# Altium project STM32_BluePill.PrjPcb
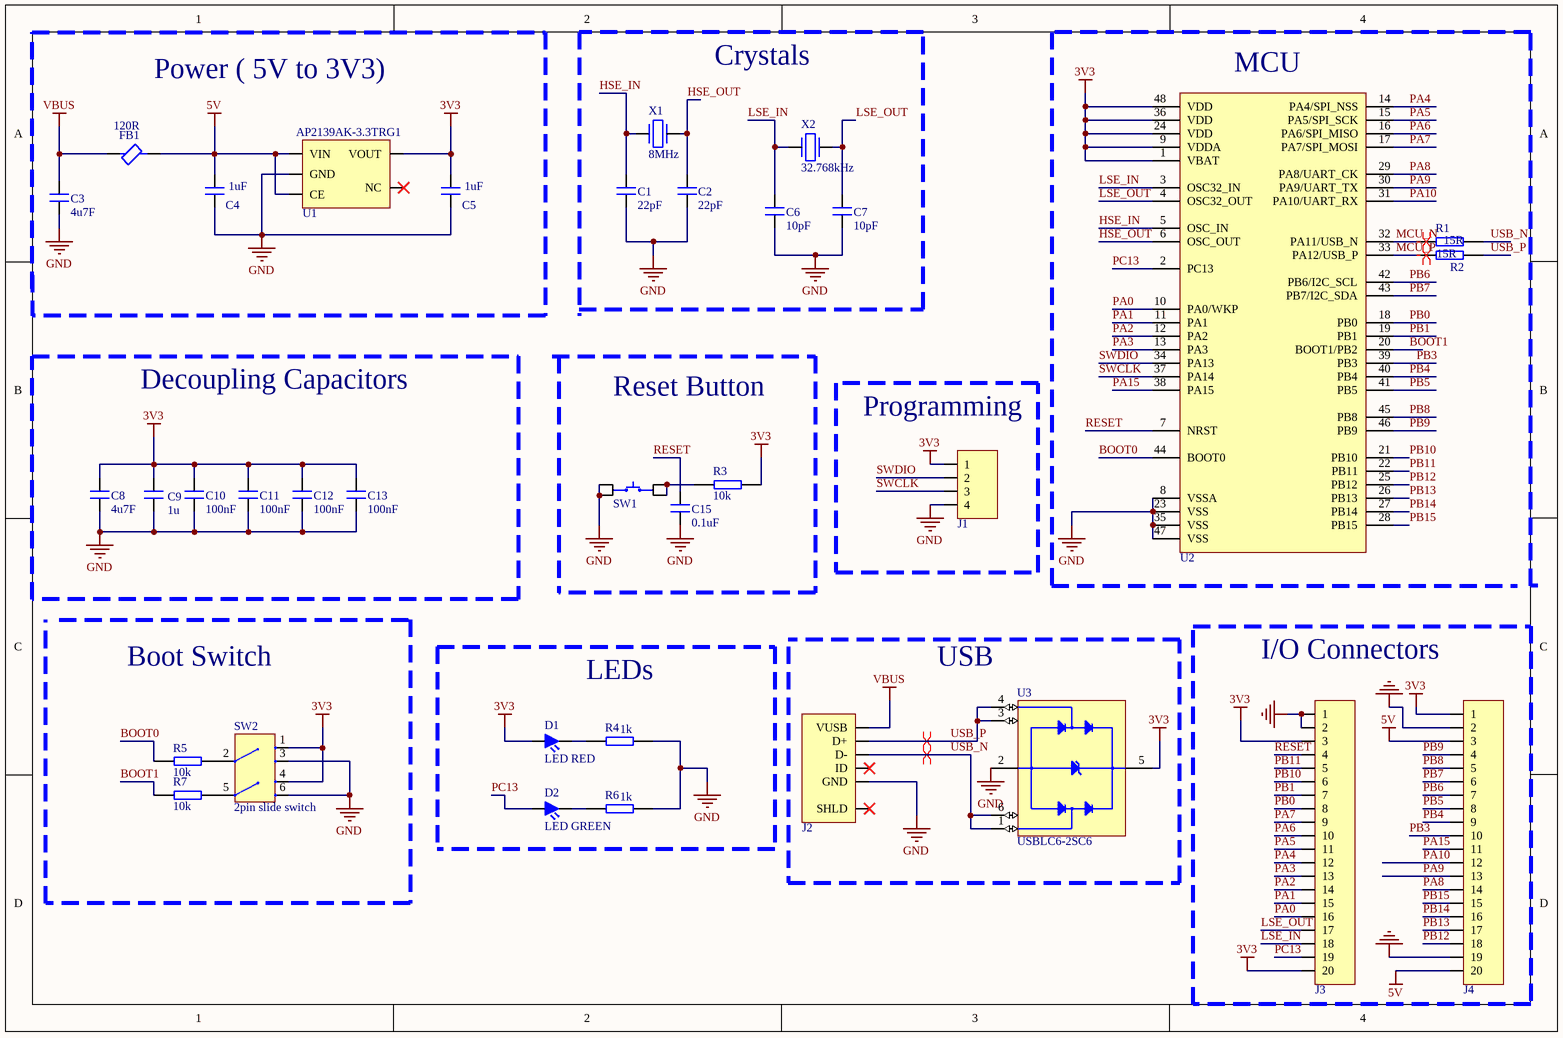
[diagram p0: STM32BluePill.SchDoc]
1 sheet, 35 parts. Net scope: global (net labels, ports and power ports of the same name join across sheets).
Board file: STM32_BluePill.PcbDoc

## Sheet STM32BluePill.SchDoc
size A4; SheetNumber: 1; SheetTotal: 2

### Parts
C1  22pF  [0402 CAP]
C2  22pF  [0402 CAP]
C3  4u7F  [0603 CAP]
C4  1uF  [0603 CAP]
C5  1uF  [0603 CAP]
C6  10pF  [0402 CAP]
C7  10pF  [0402 CAP]
C8  4u7F  [0603 CAP]
C9  1u  [0603 CAP]
C10  100nF  [0402 CAP]
C11  100nF  [0402 CAP]
C12  100nF  [0402 CAP]
C13  100nF  [0402 CAP]
C15  0.1uF  [0402 CAP]
D1  LED RED  [LED 0805]
D2  LED GREEN  [LED 0805]
FB1  120R  [0402 RES]
J1  Header 2.54MM 4POS 90D Male  [4pin 90degree header 2.54mm]  (value not drawn)
J2  10118192-0001LF  [10118192-0001LF]  (value not drawn)
J3  Header 2.54MM 20POS Male  [20pin Male Header 2.54mm]  (value not drawn)
J4  Header 2.54MM 20POS Male  [20pin Male Header 2.54mm]  (value not drawn)
R1  15R  [0402 RES]
R2  15R  [0402 RES]
R3  10k  [0402 RES]
R4  1k  [0402 RES]
R5  10k  [0402 RES]
R6  1k  [0402 RES]
R7  10k  [0402 RES]
SW1  SWITCH TACTILE  [4 pin tactile switch]  (value not drawn)
SW2  2pin slide switch  [CAS-D20TA]
U1  AP2139AK-3.3TRG1  [SOT-23-5]
U2  STM32F103C6T6A  [LQFP-48]  (value not drawn)
U3  USBLC6-2SC6  [SOT23-6]
X1  8MHz  [XR8M000000S416]
X2  32.768kHz  [ECX-1210]

### Blocks framed on the sheet
Decoupling Capacitors: C8-C13
Programming: J1
I/O Connectors: J3 J4
LEDs: D1 D2 R4 R6

### Nets
3V3: C5.2 C8.2 C9.2 C10.2 C11.2 C12.2 C13.2 D1.2 J1.1 J3.3 J3.20 J4.1 R3.2 SW2.1 SW2.4 U1.5(VOUT) U2.1(VBAT) U2.9(VDDA) U2.24(VDD) U2.36(VDD) U2.48(VDD) U3.5(VBUS)
5V: C4.2 FB1.2 J4.3 J4.20 U1.1(VIN) U1.3(CE)
GND: C1.1 C2.1 C3.1 C4.1 C5.1 C6.1 C7.1 C8.1 C9.1 C10.1 C11.1 C12.1 C13.1 C15.1 J1.4 J2.5(GND) J3.1 J3.2 J4.2 J4.19 R4.2 R6.2 SW1.1 SW1.3 SW2.3 SW2.6 U1.2(GND) U2.8(VSSA) U2.23(VSS) U2.35(VSS) U2.47(VSS) U3.2(GND)
VBUS: C3.2 FB1.1 J2.1(VUSB)
BOOT0: R5.1 U2.44(BOOT0)
BOOT1: R7.1 U2.20(BOOT1/PB2)
HSE_IN: C1.2 U2.5(OSC_IN) X1.1
HSE_OUT: C2.2 U2.6(OSC_OUT) X1.2
LSE_IN: C6.2 J3.18 U2.3(OSC32_IN) X2.2
LSE_OUT: C7.2 J3.17 U2.4(OSC32_OUT) X2.1
MCU_N: R1.2 U2.32(PA11/USB_N)
MCU_P: R2.1 U2.33(PA12/USB_P)
PA0: J3.16 U2.10(PA0/WKP)
PA1: J3.15 U2.11(PA1)
PA2: J3.14 U2.12(PA2)
PA3: J3.13 U2.13(PA3)
PA4: J3.12 U2.14(PA4/SPI_NSS)
PA5: J3.11 U2.15(PA5/SPI_SCK)
PA6: J3.10 U2.16(PA6/SPI_MISO)
PA7: J3.9 U2.17(PA7/SPI_MOSI)
PA8: J4.14 U2.29(PA8/UART_CK)
PA9: J4.13 U2.30(PA9/UART_TX)
PA10: J4.12 U2.31(PA10/UART_RX)
PA15: J4.11 U2.38(PA15)
PB0: J3.8 U2.18(PB0)
PB1: J3.7 U2.19(PB1)
PB3: J4.10 U2.39(PB3)
PB4: J4.9 U2.40(PB4)
PB5: J4.8 U2.41(PB5)
PB6: J4.7 U2.42(PB6/I2C_SCL)
PB7: J4.6 U2.43(PB7/I2C_SDA)
PB8: J4.5 U2.45(PB8)
PB9: J4.4 U2.46(PB9)
PB10: J3.6 U2.21(PB10)
PB11: J3.5 U2.22(PB11)
PB12: J4.18 U2.25(PB12)
PB13: J4.17 U2.26(PB13)
PB14: J4.16 U2.27(PB14)
PB15: J4.15 U2.28(PB15)
PC13: D2.2 J3.19 U2.2(PC13)
RESET: C15.2 J3.4 U2.7(NRST)
SWCLK: J1.3 U2.37(PA14)
SWDIO: J1.2 U2.34(PA13)
USB_N: J2.3(D-) R1.1 U3.1(I/O1) U3.6(I/O1)
USB_P: J2.2(D+) R2.2 U3.3(I/O2) U3.4(I/O2)
NetD1_1: D1.1 R4.1
NetD2_1: D2.1 R6.1
NetR3_1: R3.1 SW1.2 SW1.4
NetR5_2: R5.2 SW2.2
NetR7_2: R7.2 SW2.5

Not connected (* = marked no-connect by the designer): J2 4(ID)* 6(SHLD)*; U1 4(NC)*

### Layout directives
differential pair: MCU_N, MCU_P, USB_N, USB_P

### Notes on the sheet
- Power ( 5V to 3V3)
- Crystals
- (near U2) MCU
- Reset Button
- Boot Switch
- (near U3) USB

### Library data of the parts
C1 C2 = 0402 22p CAP: Ceramic Capacitor, Multilayer, Ceramic, 50V, 5% +Tol, 5% -Tol, C0G, 30ppm/Cel TC, 0.000022uF, Surface Mount, 0402; Manufacturer: Murata; Manufacturer Part Number: GRM1555C1H220JA01D; Multilayer: Yes; Case: 0402; Supplier: Digikey; Supplier Part Number: 490-5868-1-ND; RoHS: Yes; Category: Ceramic Capacitors; Stock: 1670141; Pricing: 1=0,1, 10=0,029, 50=0,0166, 100=0,0129, 500=0,00974, 1000=0,00765, 2500=0,00695, 5000=0,0064 (USD); Mounting Technology: Surface Mount; Pins: 2; Package Shape: Rectangular; Case/Package: 0402; Terminal Finish: Nickel; Dielectric Material: Ceramic; Min Operating Temperature: -55°C; Max Operating Temperature: 125°C; JESD-609 Code: e3; Package Style: SMTMeter; Packaging: Tape and Reel; Termination: Wraparound; Value: 22pF; Capacitor Type: Ceramic; Tolerance  (fill in as +-): 5%; Tolerance (fill in as +-): 5%; Rated DC Voltage (URdc): 50V; Temperature Characteristics Code: C0G; Length: 1mm; Width: 0.5mm; Height: 0.5mm; Reach SVHC Compliant: Yes; RoHS Compliant: Yes; ComponentLink1URL: https://datasheet.ciiva.com:443/pdfs/VipMasterIC/IC/MURE/MURE-S-A0008911154/MURE-S-A0008911207-1.pdf?src-supplier=IHS+Markit; ComponentLink1Description: https://datasheet.ciiva.com:443/pdfs/VipMasterIC/IC/MURE/MURE-S-A0008911154/MURE-S-A0008911207-1.pdf?src-supplier=IHS+Markit; ComponentLink2URL: https://datasheet.ciiva.com/6277/product-6277809.pdf?src-supplier=Digikey; ComponentLink2Description: https://datasheet.ciiva.com/6277/product-6277809.pdf?src-supplier=Digikey; ComponentLink3URL: https://datasheet.ciiva.com/29200/453714-da-01-en-vs-kondensator-0402-29200051.pdf?src-supplier=Conrad; ComponentLink3Description: https://datasheet.ciiva.com/29200/453714-da-01-en-vs-kondensator-0402-29200051.pdf?src-supplier=Conrad; ComponentLink4URL: https://datasheet.ciiva.com/7828/1666664-7828846.pdf?src-supplier=Element14; ComponentLink4Description: https://datasheet.ciiva.com/7828/1666664-7828846.pdf?src-supplier=Element14
C3 C8 = 0603 4u7 CAP: Ceramic Capacitor, Multilayer, Ceramic, 25V, 10% +Tol, 10% -Tol, X5R, 15% TC, 4.7uF, Surface Mount, 0603; Manufacturer: Samsung; Manufacturer Part Number: CL10A475KA8NQNC; Multilayer: Yes; Case: 0603; Supplier: Digikey; Supplier Part Number: 1276-1900-1-ND; RoHS: Yes; Category: Ceramic Capacitors; Stock: 1806164; Pricing: 1=0,35, 10=0,226, 50=0,1584, 100=0,1279, 500=0,09502, 1000=0,08314 (USD); Mounting Technology: Surface Mount; Pins: 2; Package Shape: Rectangular; Terminal Finish: Nickel; Dielectric Material: Ceramic; Case/Package: 0603; Min Operating Temperature: -55°C; Max Operating Temperature: 85°C; JESD-609 Code: e3; Package Style: SMTMeter; Value: 4.7uF; Capacitor Type: Ceramic; Tolerance  (fill in as +-): 10%; Packaging: Tape and Reel; Tolerance (fill in as +-): 10%; Rated DC Voltage (URdc): 25V; Temperature Characteristics Code: X5R; Termination: Wraparound; Length: 1.6mm; Width: 0.8mm; Height: 0.95mm; Reach SVHC Compliant: Yes; RoHS Compliant: Yes; ComponentLink1URL: https://datasheet.ciiva.com:443/pdfs/VipMasterIC/IC/SEMS/SEMS-S-A0008384515/SEMS-S-A0008873295-1.pdf?src-supplier=IHS+Markit; ComponentLink1Description: https://datasheet.ciiva.com:443/pdfs/VipMasterIC/IC/SEMS/SEMS-S-A0008384515/SEMS-S-A0008873295-1.pdf?src-supplier=IHS+Markit; ComponentLink2URL: https://datasheet.ciiva.com/25787/cl10a475ka8nqnc-25787017.pdf?src-supplier=Digikey; ComponentLink2Description: https://datasheet.ciiva.com/25787/cl10a475ka8nqnc-25787017.pdf?src-supplier=Digikey
C4 C5 C9 = 0603 1u CAP: Ceramic Capacitor, Multilayer, Ceramic, 25V, 10% +Tol, 10% -Tol, X7R, 15% TC, 1uF, Surface Mount, 0603; Manufacturer: Murata; Manufacturer Part Number: GCM188R71E105KA64D; Multilayer: Yes; Reference Standard: AEC-Q200; Case: 0603; Supplier: Digikey; Supplier Part Number: 490-10673-6-ND; RoHS: Yes; Category: Ceramic Capacitors; Stock: 2612025; Pricing: 1=0,24, 10=0,158, 50=0,1, 100=0,08, 500=0,05776, 1000=0,0511 (USD); Mounting Technology: Surface Mount; Pins: 2; Dielectric Material: Ceramic; Package Shape: Rectangular; Case/Package: 0603; Terminal Finish: Nickel; Min Operating Temperature: -55°C; Max Operating Temperature: 125°C; JESD-609 Code: e3; Value: 1uF; Capacitor Type: Ceramic; Tolerance  (fill in as +-): 10%; Package Style: SMTMeter; Packaging: Tape and Reel; Tolerance (fill in as +-): 10%; Rated DC Voltage (URdc): 25V; Temperature Characteristics Code: X7R; Termination: Wraparound; Length: 1.6mm; Width: 0.8mm; Height: 0.9mm; Reach SVHC Compliant: Yes; RoHS Compliant: Yes; ComponentLink1URL: https://datasheet.ciiva.com:443/pdfs/VipMasterIC/IC/MURE/MURE-S-A0004362469/MURE-S-A0004362812-1.pdf?src-supplier=IHS+Markit; ComponentLink1Description: https://datasheet.ciiva.com:443/pdfs/VipMasterIC/IC/MURE/MURE-S-A0004362469/MURE-S-A0004362812-1.pdf?src-supplier=IHS+Markit; ComponentLink2URL: https://datasheet.ciiva.com/11616/product-11616499.pdf?src-supplier=Avnet; ComponentLink2Description: https://datasheet.ciiva.com/11616/product-11616499.pdf?src-supplier=Avnet; ComponentLink3URL: https://datasheet.ciiva.com/26843/getdatasheetpartid-562446-26843671.pdf?src-supplier=Verical; ComponentLink3Description: https://datasheet.ciiva.com/26843/getdatasheetpartid-562446-26843671.pdf?src-supplier=Verical
C6 C7 = 0402 10p CAP: Ceramic Capacitor, Multilayer, Ceramic, 25V, 2% +Tol, 2% -Tol, C0G, 30ppm/Cel TC, 0.00001uF, Surface Mount, 01005; Manufacturer: Murata; Manufacturer Part Number: GRM0225C1E100GA03L; Multilayer: Yes; Case: 0402; Supplier: Digikey; Supplier Part Number: 490-13464-2-ND; RoHS: Yes; Category: Ceramic Capacitors; Stock: 400000; Pricing: 40000=0,00724, 80000=0,00648, 120000=0,00524, 200000=0,00507, 280000=0,00476 (USD); Mounting Technology: Surface Mount; Pins: 2; Dielectric Material: Ceramic; Package Shape: Rectangular; Min Operating Temperature: -55°C; Max Operating Temperature: 125°C; Value: 10pF; Capacitor Type: Ceramic; Tolerance  (fill in as +-): 2%; Packaging: Tape and Reel; Tolerance (fill in as +-): 2%; Rated DC Voltage (URdc): 25V; Temperature Characteristics Code: C0G; Termination: Wraparound; Reach SVHC Compliant: Yes; RoHS Compliant: Yes; ComponentLink1URL: https://datasheet.ciiva.com:443/pdfs/VipMasterIC/IC/MURE/MURE-S-A0004430058/MURE-S-A0004435504-1.pdf?src-supplier=IHS+Markit; ComponentLink1Description: https://datasheet.ciiva.com:443/pdfs/VipMasterIC/IC/MURE/MURE-S-A0004430058/MURE-S-A0004435504-1.pdf?src-supplier=IHS+Markit; ComponentLink2URL: https://search.murata.co.jp/Ceramy/image/img/A01X/G101/ENG/GRM0225C1E100GA03-01.pdf?src-supplier=Digikey; ComponentLink2Description: https://search.murata.co.jp/Ceramy/image/img/A01X/G101/ENG/GRM0225C1E100GA03-01.pdf?src-supplier=Digikey; ComponentLink3URL: http://search.murata.co.jp/Ceramy/image/img/A01X/G101/ENG/GRM0225C1E100GA03-01.pdf?src-supplier=Digikey; ComponentLink3Description: http://search.murata.co.jp/Ceramy/image/img/A01X/G101/ENG/GRM0225C1E100GA03-01.pdf?src-supplier=Digikey
C10-C13 = 0402 100n AP: Ceramic Capacitor, Multilayer, Ceramic, 25V, 10% +Tol, 10% -Tol, X7R, 15% TC, 0.1uF, Surface Mount, 0402; Manufacturer: Murata; Manufacturer Part Number: GRM155R71E104KE14J; Multilayer: Yes; Case: 0402; Supplier: Digikey; Supplier Part Number: 490-14603-1-ND; RoHS: Yes; Category: Ceramic Capacitors; Stock: 3911559; Pricing: 1=0,1, 10=0,024, 50=0,0136, 100=0,0105, 500=0,00794, 1000=0,00623, 2500=0,00566, 5000=0,00521 (USD); Mounting Technology: Surface Mount; Pins: 2; Dielectric Material: Ceramic; Package Shape: Rectangular; Case/Package: 0402; Terminal Finish: Nickel; Min Operating Temperature: -55°C; Max Operating Temperature: 125°C; JESD-609 Code: e3; Value: 100nF; Capacitor Type: Ceramic; Tolerance  (fill in as +-): 10%; Package Style: SMTMeter; Packaging: Tape and Reel; Tolerance (fill in as +-): 10%; Rated DC Voltage (URdc): 25V; Temperature Characteristics Code: X7R; Termination: Wraparound; Length: 1mm; Width: 0.5mm; Height: 0.5mm; Reach SVHC Compliant: Yes; RoHS Compliant: Yes; ComponentLink1URL: https://datasheet.ciiva.com:443/pdfs/VipMasterIC/IC/MURE/MURE-S-A0004362469/MURE-S-A0004364872-1.pdf?src-supplier=IHS+Markit; ComponentLink1Description: https://datasheet.ciiva.com:443/pdfs/VipMasterIC/IC/MURE/MURE-S-A0004362469/MURE-S-A0004364872-1.pdf?src-supplier=IHS+Markit; ComponentLink2URL: http://www.mouser.com/ds/2/281/c02e-2905.pdf?src-supplier=Mouser; ComponentLink2Description: http://www.mouser.com/ds/2/281/c02e-2905.pdf?src-supplier=Mouser; ComponentLink3URL: https://datasheet.octopart.com/GRM155R71E104KE14J-Murata-datasheet-155345056.pdf?src-supplier=Element14; ComponentLink3Description: https://datasheet.octopart.com/GRM155R71E104KE14J-Murata-datasheet-155345056.pdf?src-supplier=Element14; ComponentLink4URL: http://search.murata.co.jp/Ceramy/image/img/A01X/G101/ENG/GRM155R71E104KE14-01.pdf?src-supplier=Digikey; ComponentLink4Description: http://search.murata.co.jp/Ceramy/image/img/A01X/G101/ENG/GRM155R71E104KE14-01.pdf?src-supplier=Digikey; ComponentLink5URL: https://datasheet.octopart.com/GRM155R71E104KE14J-Murata-datasheet-165579666.pdf?src-supplier=TME; ComponentLink5Description: https://datasheet.octopart.com/GRM155R71E104KE14J-Murata-datasheet-165579666.pdf?src-supplier=TME
C15 = 0402 100n AP: Ceramic Capacitor, Multilayer, Ceramic, 25V, 10% +Tol, 10% -Tol, X7R, 15% TC, 0.1uF, Surface Mount, 0402; Manufacturer: Murata; Manufacturer Part Number: GRM155R71E104KE14J; Value: 100nF; Multilayer: Yes; Case: 0402; Supplier: Digikey; Supplier Part Number: 490-14603-1-ND; RoHS: Yes; Category: Ceramic Capacitors; Stock: 3911559; Pricing: 1=0,1, 10=0,024, 50=0,0136, 100=0,0105, 500=0,00794, 1000=0,00623, 2500=0,00566, 5000=0,00521 (USD); Mounting Technology: Surface Mount; Pins: 2; Dielectric Material: Ceramic; Package Shape: Rectangular; Case/Package: 0402; Terminal Finish: Nickel; Min Operating Temperature: -55°C; Max Operating Temperature: 125°C; JESD-609 Code: e3; Capacitor Type: Ceramic; Tolerance  (fill in as +-): 10%; Package Style: SMTMeter; Packaging: Tape and Reel; Tolerance (fill in as +-): 10%; Rated DC Voltage (URdc): 25V; Temperature Characteristics Code: X7R; Termination: Wraparound; Length: 1mm; Width: 0.5mm; Height: 0.5mm; Reach SVHC Compliant: Yes; RoHS Compliant: Yes; ComponentLink1URL: https://datasheet.ciiva.com:443/pdfs/VipMasterIC/IC/MURE/MURE-S-A0004362469/MURE-S-A0004364872-1.pdf?src-supplier=IHS+Markit; ComponentLink1Description: https://datasheet.ciiva.com:443/pdfs/VipMasterIC/IC/MURE/MURE-S-A0004362469/MURE-S-A0004364872-1.pdf?src-supplier=IHS+Markit; ComponentLink2URL: http://www.mouser.com/ds/2/281/c02e-2905.pdf?src-supplier=Mouser; ComponentLink2Description: http://www.mouser.com/ds/2/281/c02e-2905.pdf?src-supplier=Mouser; ComponentLink3URL: https://datasheet.octopart.com/GRM155R71E104KE14J-Murata-datasheet-155345056.pdf?src-supplier=Element14; ComponentLink3Description: https://datasheet.octopart.com/GRM155R71E104KE14J-Murata-datasheet-155345056.pdf?src-supplier=Element14; ComponentLink4URL: http://search.murata.co.jp/Ceramy/image/img/A01X/G101/ENG/GRM155R71E104KE14-01.pdf?src-supplier=Digikey; ComponentLink4Description: http://search.murata.co.jp/Ceramy/image/img/A01X/G101/ENG/GRM155R71E104KE14-01.pdf?src-supplier=Digikey; ComponentLink5URL: https://datasheet.octopart.com/GRM155R71E104KE14J-Murata-datasheet-165579666.pdf?src-supplier=TME; ComponentLink5Description: https://datasheet.octopart.com/GRM155R71E104KE14J-Murata-datasheet-165579666.pdf?src-supplier=TME
D1 = LED RED 0805
D2 = LED GREEN 0805
FB1 = Ferritte Bead 120R 0402: Ferrite Chip, 1 Function(s), 0.9A, 2 Pin(s) / BLM15PD121SN1D; Manufacturer: Murata; DC Resistance-Max: 90mR; Clock Frequency: 100MHz; Channels: 1; Current Rating: 900mA; Supplier: Digikey; Supplier Part Number: 490-5203-6-ND; Manufacturer Part Number: BLM15PD121SN1D; RoHS: Yes; Category: Ferrite Beads and Chips; Stock: 709858; Pricing: 1=0,1, 10=0,068, 25=0,0616, 50=0,0556, 100=0,0408, 250=0,02968, 500=0,0272, 1000=0,02348, 5000=0,01854 (USD); Mounting Technology: Surface Mount; Material: Ferrite; Case Code: 0402; Terminal Finish: Nickel; Min Operating Temperature: -55°C; Max Operating Temperature: 125°C; JESD-609 Code: e3; Construction: Chip Bead; Filter Type: FERRITE CHIP; Min Frequency: 100MHz; Output Impedance: 120R; Packaging: Tape and Reel; Length: 1mm; Width: 0.5mm; Height: 0.5mm; Reach SVHC Compliant: Yes; RoHS Compliant: Yes; ComponentLink1URL: https://datasheet.ciiva.com:443/pdfs/VipMasterIC/IC/MURE/MURE-S-A0010009827/MURE-S-A0010009827-1.pdf?src-supplier=IHS+Markit; ComponentLink1Description: https://datasheet.ciiva.com:443/pdfs/VipMasterIC/IC/MURE/MURE-S-A0010009827/MURE-S-A0010009827-1.pdf?src-supplier=IHS+Markit
J2 = micro b usb connector: CONN USB MICRO B RECPT SMT R/A; Manufacturer: Amphenol ICC / FCI; Supplier: Digikey; Supplier Part Number: 609-4613-1-ND; Manufacturer Part Number: 10118192-0001LF; RoHS: No; Category: Uncategorized; Stock: 76957; Pricing: 1=0,46, 10=0,404, 25=0,3696, 50=0,3478, 100=0,3334, 250=0,30436, 500=0,28988 (USD)
R1 R2 = 0402 15R RES: Fixed Resistor, Metal Glaze/thick Film, 0.0625W, 15ohm, 50V, 1% +/-Tol, 100ppm/Cel, Surface Mount, 0402; Manufacturer: Yageo; Manufacturer Part Number: RC0402FR-0715RL; Additional Feature: LASER TRIMMABLE; Power: 62.5mW; Rated Temperature: 70°C; Temperature Coefficient: 100ppm/°C; Package Height: 0.35mm; Package Length: 1mm; Package Width: 0.5mm; Case: 0402; Supplier: Digikey; Supplier Part Number: 311-15LRCT-ND; RoHS: Yes; Category: Chip SMD Resistors; Stock: 374901; Pricing: 1=0,1, 10=0,015, 50=0,0088, 100=0,0073, 500=0,00488, 1000=0,00417, 5000=0,00297 (USD); Mounting Technology: Surface Mount; Pins: 2; Package Shape: Rectangular; Case/Package: 0402; Terminal Finish: Nickel; Min Operating Temperature: -55°C; Max Operating Temperature: 155°C; Tolerance: 1%; JESD-609 Code: e3; Resistor Type: FIXED RESISTOR; Construction: Chip; Package Style: SMTMeter; Packaging: Tape and Reel; Value: 15R; Technology: METAL GLAZE/THICK FILM; Termination: Wraparound; Working Voltage: 50V; Reach SVHC Compliant: Yes; RoHS Compliant: Yes; ComponentLink1URL: https://datasheet.ciiva.com:443/pdfs/VipMasterIC/IC/YAGO/YAGO-S-A0008145938/YAGO-S-A0008145938-1.pdf?src-supplier=IHS+Markit; ComponentLink1Description: https://datasheet.ciiva.com:443/pdfs/VipMasterIC/IC/YAGO/YAGO-S-A0008145938/YAGO-S-A0008145938-1.pdf?src-supplier=IHS+Markit; ComponentLink2URL: https://datasheet.ciiva.com/2518/pyu-r-int-thick-7-2518950.pdf?src-supplier=Digikey; ComponentLink2Description: https://datasheet.ciiva.com/2518/pyu-r-int-thick-7-2518950.pdf?src-supplier=Digikey; ComponentLink3URL: https://datasheet.ciiva.com/2518/pyu-r-int-thick-7-2518951.pdf?src-supplier=Digikey; ComponentLink3Description: https://datasheet.ciiva.com/2518/pyu-r-int-thick-7-2518951.pdf?src-supplier=Digikey; ComponentLink4URL: https://datasheet.ciiva.com/2518/pyu-r-int-thick-7-2518949.pdf?src-supplier=Digikey; ComponentLink4Description: https://datasheet.ciiva.com/2518/pyu-r-int-thick-7-2518949.pdf?src-supplier=Digikey; ComponentLink5URL: https://datasheet.ciiva.com/12558/pyu-rc0402-51-rohs-l-6-r-8721-12558367.pdf?src-supplier=Mouser; ComponentLink5Description: https://datasheet.ciiva.com/12558/pyu-rc0402-51-rohs-l-6-r-8721-12558367.pdf?src-supplier=Mouser; ComponentLink6URL: https://datasheet.ciiva.com/16740/pyu-rc0402-51-rohs-l-6-r-16740598.pdf?src-supplier=Future+Electronics; ComponentLink6Description: https://datasheet.ciiva.com/16740/pyu-rc0402-51-rohs-l-6-r-16740598.pdf?src-supplier=Future+Electronics
R3 R5 R7 = 0402 10k RES: Fixed Resistor, Metal Glaze/thick Film, 0.06W, 10000ohm, 50V, 1% +/-Tol, 100ppm/Cel, Surface Mount, 0402; Manufacturer: Samsung; Manufacturer Part Number: RC1005F103CS; Power: 60mW; Value: 10kR; Temperature Coefficient: 100ppm/°C; Package Height: 0.35mm; Package Length: 1mm; Package Width: 0.5mm; Case: 0402; Supplier: Digikey; Supplier Part Number: 1276-3431-1-ND; RoHS: Yes; Category: Chip SMD Resistors; Stock: 45634757; Pricing: 1=0,1, 10=0,024, 50=0,0156, 100=0,0132, 500=0,00922, 1000=0,00803, 5000=0,00598 (USD); Mounting Technology: Surface Mount; Pins: 2; Package Shape: Rectangular; Case/Package: 0402; Terminal Finish: Nickel; Min Operating Temperature: -55°C; Max Operating Temperature: 125°C; Tolerance: 1%; JESD-609 Code: e3; Resistor Type: FIXED RESISTOR; Construction: Chip; Package Style: SMTMeter; Packaging: Tape and Reel; Technology: METAL GLAZE/THICK FILM; Working Voltage: 50V; Reach SVHC Compliant: Yes; RoHS Compliant: Yes; ComponentLink1URL: https://datasheet.ciiva.com:443/pdfs/VipMasterIC/IC/SEMS/SEMS-S-A0001326806/SEMS-S-A0001326806-1.pdf?src-supplier=IHS+Markit; ComponentLink1Description: https://datasheet.ciiva.com:443/pdfs/VipMasterIC/IC/SEMS/SEMS-S-A0001326806/SEMS-S-A0001326806-1.pdf?src-supplier=IHS+Markit; ComponentLink2URL: https://datasheet.ciiva.com/15196/getdatasheetpartid-504789-15196214.pdf?src-supplier=Verical; ComponentLink2Description: https://datasheet.ciiva.com/15196/getdatasheetpartid-504789-15196214.pdf?src-supplier=Verical; ComponentLink3URL: https://datasheet.ciiva.com/16481/rcseries-16481007.pdf?src-supplier=Future+Electronics; ComponentLink3Description: https://datasheet.ciiva.com/16481/rcseries-16481007.pdf?src-supplier=Future+Electronics
R4 R6 = 0402 1k RES: Fixed Resistor, Metal Glaze/thick Film, 0.06W, 10000ohm, 50V, 1% +/-Tol, 100ppm/Cel, Surface Mount, 0402; Manufacturer: Samsung; Manufacturer Part Number: RC1005F103CS; Power: 60mW; Value: 10kR; Temperature Coefficient: 100ppm/°C; Package Height: 0.35mm; Package Length: 1mm; Package Width: 0.5mm; Case: 0402; Supplier: Digikey; Supplier Part Number: 1276-3431-1-ND; RoHS: Yes; Category: Chip SMD Resistors; Stock: 45634757; Pricing: 1=0,1, 10=0,024, 50=0,0156, 100=0,0132, 500=0,00922, 1000=0,00803, 5000=0,00598 (USD); Mounting Technology: Surface Mount; Pins: 2; Package Shape: Rectangular; Case/Package: 0402; Terminal Finish: Nickel; Min Operating Temperature: -55°C; Max Operating Temperature: 125°C; Tolerance: 1%; JESD-609 Code: e3; Resistor Type: FIXED RESISTOR; Construction: Chip; Package Style: SMTMeter; Packaging: Tape and Reel; Technology: METAL GLAZE/THICK FILM; Working Voltage: 50V; Reach SVHC Compliant: Yes; RoHS Compliant: Yes; ComponentLink1URL: https://datasheet.ciiva.com:443/pdfs/VipMasterIC/IC/SEMS/SEMS-S-A0001326806/SEMS-S-A0001326806-1.pdf?src-supplier=IHS+Markit; ComponentLink1Description: https://datasheet.ciiva.com:443/pdfs/VipMasterIC/IC/SEMS/SEMS-S-A0001326806/SEMS-S-A0001326806-1.pdf?src-supplier=IHS+Markit; ComponentLink2URL: https://datasheet.ciiva.com/15196/getdatasheetpartid-504789-15196214.pdf?src-supplier=Verical; ComponentLink2Description: https://datasheet.ciiva.com/15196/getdatasheetpartid-504789-15196214.pdf?src-supplier=Verical; ComponentLink3URL: https://datasheet.ciiva.com/16481/rcseries-16481007.pdf?src-supplier=Future+Electronics; ComponentLink3Description: https://datasheet.ciiva.com/16481/rcseries-16481007.pdf?src-supplier=Future+Electronics
SW1 = SWITCH TACTILE: TL3305BF260QG Keypad Switch, 1 Switches, SPST, Momentary, 0.05A, 12VDC, 3.04N, Solder Terminal, Surface Mount-straight; Manufacturer: E-Switch; Circuit Configuration: 1X1; Contact Current(DC)-Max: 50mA; Contact DC Max Rating R Load: .05A@12VDC; Contact Voltage(DC)-Max: 12V; Electrical Life: 200000Cycles; Number of Switches: 1; Body Breadth: 4.5inch; Body Height: 4.9mm; Body Length or Diameter: 4.5mm; Supplier: Digikey; Supplier Part Number: EG5354CT-ND; Manufacturer Part Number: TL3305BF260QG; RoHS: Yes; Category: Tactile Switches; Stock: 306451; Pricing: 1=0,22, 10=0,214, 25=0,2028, 100=0,1836, 250=0,16736, 500=0,15558 (USD); Mounting Technology: Surface Mount; Min Operating Temperature: -20°C; Max Operating Temperature: 70°C; Operating Force-Max: 3.04N; Packaging: Tape and Reel; Switch Action: MOMENTARY; Switch Function: SPST; Switch Type: Keypad; Termination: Solder; Reach SVHC Compliant: Yes; RoHS Compliant: Yes; ComponentLink1URL: https://datasheet.ciiva.com:443/pdfs/VipMasterIC/IC/ESCH/ESCH-S-A0003149373/ESCH-S-A0003149373-1.pdf?src-supplier=IHS+Markit; ComponentLink1Description: https://datasheet.ciiva.com:443/pdfs/VipMasterIC/IC/ESCH/ESCH-S-A0003149373/ESCH-S-A0003149373-1.pdf?src-supplier=IHS+Markit; ComponentLink2URL: http://www.farnell.com/datasheets/2554191.pdf?src-supplier=Farnell; ComponentLink2Description: http://www.farnell.com/datasheets/2554191.pdf?src-supplier=Farnell; ComponentLink3URL: https://sten-eswitch-13110800-production.s3.amazonaws.com/system/asset/product_line/data_sheet/213/TL3305.pdf?src-supplier=Digikey; ComponentLink3Description: https://sten-eswitch-13110800-production.s3.amazonaws.com/system/asset/product_line/data_sheet/213/TL3305.pdf?src-supplier=Digikey; ComponentLink4URL: http://spec_sheets.e-switch.com/specs/P010472.pdf?src-supplier=Digikey; ComponentLink4Description: http://spec_sheets.e-switch.com/specs/P010472.pdf?src-supplier=Digikey; ComponentLink5URL: https://datasheet.octopart.com/TL3305BF260QG-E-Switch-datasheet-100437264.pdf?src-supplier=Element14; ComponentLink5Description: https://datasheet.octopart.com/TL3305BF260QG-E-Switch-datasheet-100437264.pdf?src-supplier=Element14; ComponentLink6URL: https://datasheet.octopart.com/TL3305BF260QG-E-Switch-datasheet-62330036.pdf?src-supplier=Future+Electronics; ComponentLink6Description: https://datasheet.octopart.com/TL3305BF260QG-E-Switch-datasheet-62330036.pdf?src-supplier=Future+Electronics; ComponentLink7URL: http://www.farnell.com/datasheets/2554191.pdf?src-supplier=Newark; ComponentLink7Description: http://www.farnell.com/datasheets/2554191.pdf?src-supplier=Newark
SW2 = 2pin slide switch: SWITCH SLIDE SPDTX2 100MA 6V; Manufacturer: Nidec Copal; Actuator Material: Nylon,Polyamide; Throw Configuration: SPDT,DPDT; Max Voltage Rating (DC): 24V; Electrical Life: 2000Cycles; Switch Function: On-On; Switch Travel: 0.6mm; Operating Force: 510gf; Supplier: Digikey; Supplier Part Number: CASD20JCT-ND; Manufacturer Part Number: CAS-D20TA; RoHS: Yes; Category: DIP Switches; Stock: 42269; Pricing: 1=2,42, 10=2,356, 25=2,1428, 100=1,8616, 250=1,68712, 500=1,57076 (USD); Mounting Technology: Surface Mount; Contact Material: Copper Alloy; Contact Plating: Gold; Min Operating Temperature: -40°C; Max Operating Temperature: 85°C; Termination: J-Hook; Packaging: Cut Tape; Voltage Rating (DC): 6V; Series: CAS; Orientation: Vertical; RoHS Compliant: Yes; Lead Free: Contains Lead; ComponentLink1URL: https://datasheet.ciiva.com/2865/cas-2865269.pdf?src-supplier=Digikey; ComponentLink1Description: https://datasheet.ciiva.com/2865/cas-2865269.pdf?src-supplier=Digikey; ComponentLink2URL: https://datasheet.ciiva.com/2865/cas-2865270.pdf?src-supplier=Digikey; ComponentLink2Description: https://datasheet.ciiva.com/2865/cas-2865270.pdf?src-supplier=Digikey; ComponentLink3URL: https://datasheet.ciiva.com/2865/cas-2865268.pdf?src-supplier=Digikey; ComponentLink3Description: https://datasheet.ciiva.com/2865/cas-2865268.pdf?src-supplier=Digikey
U1 = AP2139AK-3.3TRG1: Fixed Positive LDO Regulator, 3.3V, 0.3V Dropout, CMOS, PDSO5; Manufacturer: Diodes; Package Body Material: Plastic; Dropout Voltage1-Max: 300mV; Max Supply Voltage: 6.6V; Min Input Voltage: 2.5V; Channels: 1; Output Current1-Max: 100mA; Output Voltage1-Max: 3.366V; Output Voltage1-Min: 3.234V; Regulator Type: FIXED POSITIVE SINGLE OUTPUT LDO REGULATOR; Supplier: Digikey; Supplier Part Number: AP2139AK-3.3TRG1DICT-ND; Manufacturer Part Number: AP2139AK-3.3TRG1; RoHS: Yes; Category: Voltage Regulators - Linear; Stock: 268160; Pricing: 1=0,4, 10=0,323, 25=0,2956, 100=0,2201, 250=0,19948, 500=0,16508, 1000=0,12381 (USD); Case/Package: LSSOP; Pins: 5; Package Shape: Rectangular; Terminal Finish: Tin; JESD-609 Code: e3; JESD-30 Code: R-PDSO-G5; Moisture Sensitivity Level: 3; Operating Temperature, TJ-Max: 85°C; Operating Temperature, TJ-Min: -40°C; Output Voltage1-Nom: 3.3V; Package Style: SMALL OUTLINE, LOW PROFILE, SHRINK PITCHMeter; Surface Mount: Yes; Technology: CMOS; Terminal Form: Gull Wing; Terminal Position: DUAL; Length: 2.92mm; Width: 1.6mm; Height - Seated (Max): 1.45mm; Terminal Pitch: 0.95mm; Reach SVHC Compliant: Yes; RoHS Compliant: Yes; ComponentLink1URL: https://datasheet.ciiva.com:443/pdfs/VipMasterIC/IC/DIOD/DIOD-S-A0008668704/DIOD-S-A0008668704-1.pdf?src-supplier=IHS+Markit; ComponentLink1Description: https://datasheet.ciiva.com:443/pdfs/VipMasterIC/IC/DIOD/DIOD-S-A0008668704/DIOD-S-A0008668704-1.pdf?src-supplier=IHS+Markit; ComponentLink2URL: https://datasheet.ciiva.com/29569/ap2138-9-29569029.pdf?src-supplier=Digikey; ComponentLink2Description: https://datasheet.ciiva.com/29569/ap2138-9-29569029.pdf?src-supplier=Digikey; ComponentLink3URL: https://datasheet.ciiva.com/29569/ap2138-9-29569030.pdf?src-supplier=Digikey; ComponentLink3Description: https://datasheet.ciiva.com/29569/ap2138-9-29569030.pdf?src-supplier=Digikey; ComponentLink4URL: https://datasheet.ciiva.com/30016/ap2138-9-30016781.pdf?src-supplier=Avnet; ComponentLink4Description: https://datasheet.ciiva.com/30016/ap2138-9-30016781.pdf?src-supplier=Avnet
U2 = STM32F103C6T6A: MCU 32-bit STM32F ARM Cortex M3 RISC 32KB Flash 2.5V/3.3V 48-Pin LQFP Tray; Manufacturer: STMicroelectronics; Number of Timers/Counters: 3; Max Supply Voltage: 3.6V; Interface: I2C,SPI,USART; RAM Size: 10KB; Number of I/Os: 37; Min Supply Voltage: 2V; Data Bus Width: 32b; Clock Frequency: 72MHz; Number of ADC Channels: 10; Designed by: Mert Ali Şentürk; Supplier: Digi-Key; Supplier Part Number: 497-11515-ND; Manufacturer Part Number: STM32F103C6T6A; RoHS: Yes; Category: Microcontrollers; Stock: 178; Pricing: 1=6,37, 10=5,723, 25=5,4104, 80=4,689, 250=4,44852, 500=3,99166, 1000=3,36645, 2500=3,19813 (USD); Case/Package: LQFP; Pins: 48; Weight: 0.006409oz; Min Operating Temperature: -40°C; Max Operating Temperature: 85°C; Packaging: Tray; Series: STM32F103C6; Package Quantity: 1500; Memory Format: FLASH; Memory Size: 32KB; Core Architecture: ARM; Length: 7mm; Width: 7mm; Height: 1.4mm; Lead Free: Lead Free; RoHS Compliant: Yes; ComponentLink1URL: https://datasheet.ciiva.com/15122/getdatasheetpartid-69879-15122075.pdf?src-supplier=Verical; ComponentLink1Description: https://datasheet.ciiva.com/15122/getdatasheetpartid-69879-15122075.pdf?src-supplier=Verical; ComponentLink2URL: https://datasheet.ciiva.com/14100/pustm-arm-microcont-stm32f103-en-14100507.pdf?src-supplier=Distrelec; ComponentLink2Description: https://datasheet.ciiva.com/14100/pustm-arm-microcont-stm32f103-en-14100507.pdf?src-supplier=Distrelec
U3 = USB Protection: Trans Voltage Suppressor Diode, 5V V(RWM), Unidirectional, 1 Element, Silicon; Manufacturer: STMicroelectronics; Package Body Material: Plastic; Additional Feature: HIGH RELIABILITY; Min Breakdown Voltage: 6V; Number of Elements: 1; Clamping Voltage-Max: 17V; Reference Standard: IEC-61000-4-2; Qualification Status: Not Qualified; Supplier: Digikey; Supplier Part Number: 497-5235-1-ND; Manufacturer Part Number: USBLC6-2SC6; RoHS: Yes; Category: TVS Diodes; Stock: 59063; Pricing: 1=0,58, 10=0,496, 100=0,3448, 500=0,2692, 1000=0,21881 (USD); Pins: 6; Package Shape: Rectangular; Terminal Finish: Tin; Diode Element Material: SILICON; Min Operating Temperature: -40°C; Max Operating Temperature: 125°C; JESD-609 Code: e3; Polarity: Unidirectional; Package Style: SMALL OUTLINEMeter; Diode Type: TRANS VOLTAGE SUPPRESSOR; JESD-30 Code: R-PDSO-G6; Moisture Sensitivity Level: 1; Rep Pk Reverse Voltage-Max: 5V; Surface Mount: Yes; Technology: AVALANCHE; Terminal Form: Gull Wing; Terminal Position: DUAL; Peak Reflow Temperature (Cel): 260°C; Reach SVHC Compliant: Yes; RoHS Compliant: Yes; ComponentLink1URL: https://datasheet.ciiva.com:443/pdfs/VipMasterIC/IC/SGST/SGSTS30336/SGSTS30336-1.pdf?src-supplier=IHS+Markit; ComponentLink1Description: https://datasheet.ciiva.com:443/pdfs/VipMasterIC/IC/SGST/SGSTS30336/SGSTS30336-1.pdf?src-supplier=IHS+Markit; ComponentLink2URL: https://datasheet.ciiva.com/1268/1690354-1268384.pdf?src-supplier=Element14; ComponentLink2Description: https://datasheet.ciiva.com/1268/1690354-1268384.pdf?src-supplier=Element14; ComponentLink3URL: https://datasheet.ciiva.com/4508/cd00050750-113117-4508433.pdf?src-supplier=Mouser; ComponentLink3Description: https://datasheet.ciiva.com/4508/cd00050750-113117-4508433.pdf?src-supplier=Mouser; ComponentLink4URL: https://datasheet.ciiva.com/15143/getdatasheetpartid-148465-15143789.pdf?src-supplier=Verical; ComponentLink4Description: https://datasheet.ciiva.com/15143/getdatasheetpartid-148465-15143789.pdf?src-supplier=Verical; ComponentLink5URL: https://datasheet.ciiva.com/16200/cd00050750-16200026.pdf?src-supplier=Future+Electronics; ComponentLink5Description: https://datasheet.ciiva.com/16200/cd00050750-16200026.pdf?src-supplier=Future+Electronics; ComponentLink6URL: https://datasheet.ciiva.com/41444/001184109-da-01-en-ic-esd-protecti-usblc6-2sc6-sot-23-6-stm-41444156.pdf?src-supplier=Conrad; ComponentLink6Description: https://datasheet.ciiva.com/41444/001184109-da-01-en-ic-esd-protecti-usblc6-2sc6-sot-23-6-stm-41444156.pdf?src-supplier=Conrad
X1 = XR8M000000S416: 8 MHz ±30ppm Crystal 16pF 80 Ohms 2-SMD, No Lead; Equivalent Series Resistance: 80 ohm; Frequency: 8M Hz; Load Capacitance: 16pF; Frequency Tolerance: 30ppm; Operating Temperature: -40°C ~ 85°C
X2 = ECS-.327-7-1210-TR ECX-1210: Parallel - Fundamental Quartz Crystal, 32.768KHz Nom 7pF ECX-1210; Manufacturer: ECS International; Aging: 3 PPM/FIRST YEAR; Drive Level: 0.1uW; Frequency Stability: 0.0144%; Frequency Tolerance: 20ppm; Operating Frequency-Nom: 0.032768; ESR: 90kR; Supplier: Digikey; Supplier Part Number: XC2284CT-ND; Manufacturer Part Number: ECS-.327-7-1210-TR; RoHS: Yes; Category: Crystals and Oscillators; Stock: 129744; Pricing: 1=0,87, 10=0,828, 50=0,8088, 100=0,6932, 500=0,67804 (USD); Mounting Technology: Surface Mount; Min Operating Temperature: -40°C; Max Operating Temperature: 85°C; Crystal/Resonator Type: PARALLEL - FUNDAMENTAL; Load Capacitance: 7pF; Reach SVHC Compliant: Yes; RoHS Compliant: Yes; ComponentLink1URL: https://datasheet.ciiva.com:443/pdfs/VipMasterIC/IC/ECSI/ECSI-S-A0009254912/ECSI-S-A0009254912-1.pdf?src-supplier=IHS+Markit; ComponentLink1Description: https://datasheet.ciiva.com:443/pdfs/VipMasterIC/IC/ECSI/ECSI-S-A0009254912/ECSI-S-A0009254912-1.pdf?src-supplier=IHS+Markit; ComponentLink2URL: https://www.ecsxtal.com/store/pdf/ECX-1210.pdf?src-supplier=Digikey; ComponentLink2Description: https://www.ecsxtal.com/store/pdf/ECX-1210.pdf?src-supplier=Digikey; ComponentLink3URL: https://datasheet.octopart.com/ECS-.327-7-1210-TR-ECS-International-datasheet-127110274.pdf?src-supplier=Future+Electronics; ComponentLink3Description: https://datasheet.octopart.com/ECS-.327-7-1210-TR-ECS-International-datasheet-127110274.pdf?src-supplier=Future+Electronics; ComponentLink4URL: https://datasheet.octopart.com/ECS-.327-7-1210-TR-ECS-International-datasheet-101965301.pdf?src-supplier=Master+Electronics; ComponentLink4Description: https://datasheet.octopart.com/ECS-.327-7-1210-TR-ECS-International-datasheet-101965301.pdf?src-supplier=Master+Electronics